# Altium schematic sheet 04-BLE.SchDoc: BLE Transreciver
size A3; DocumentNumber: 4; SheetNumber: 4; SheetTotal: 15
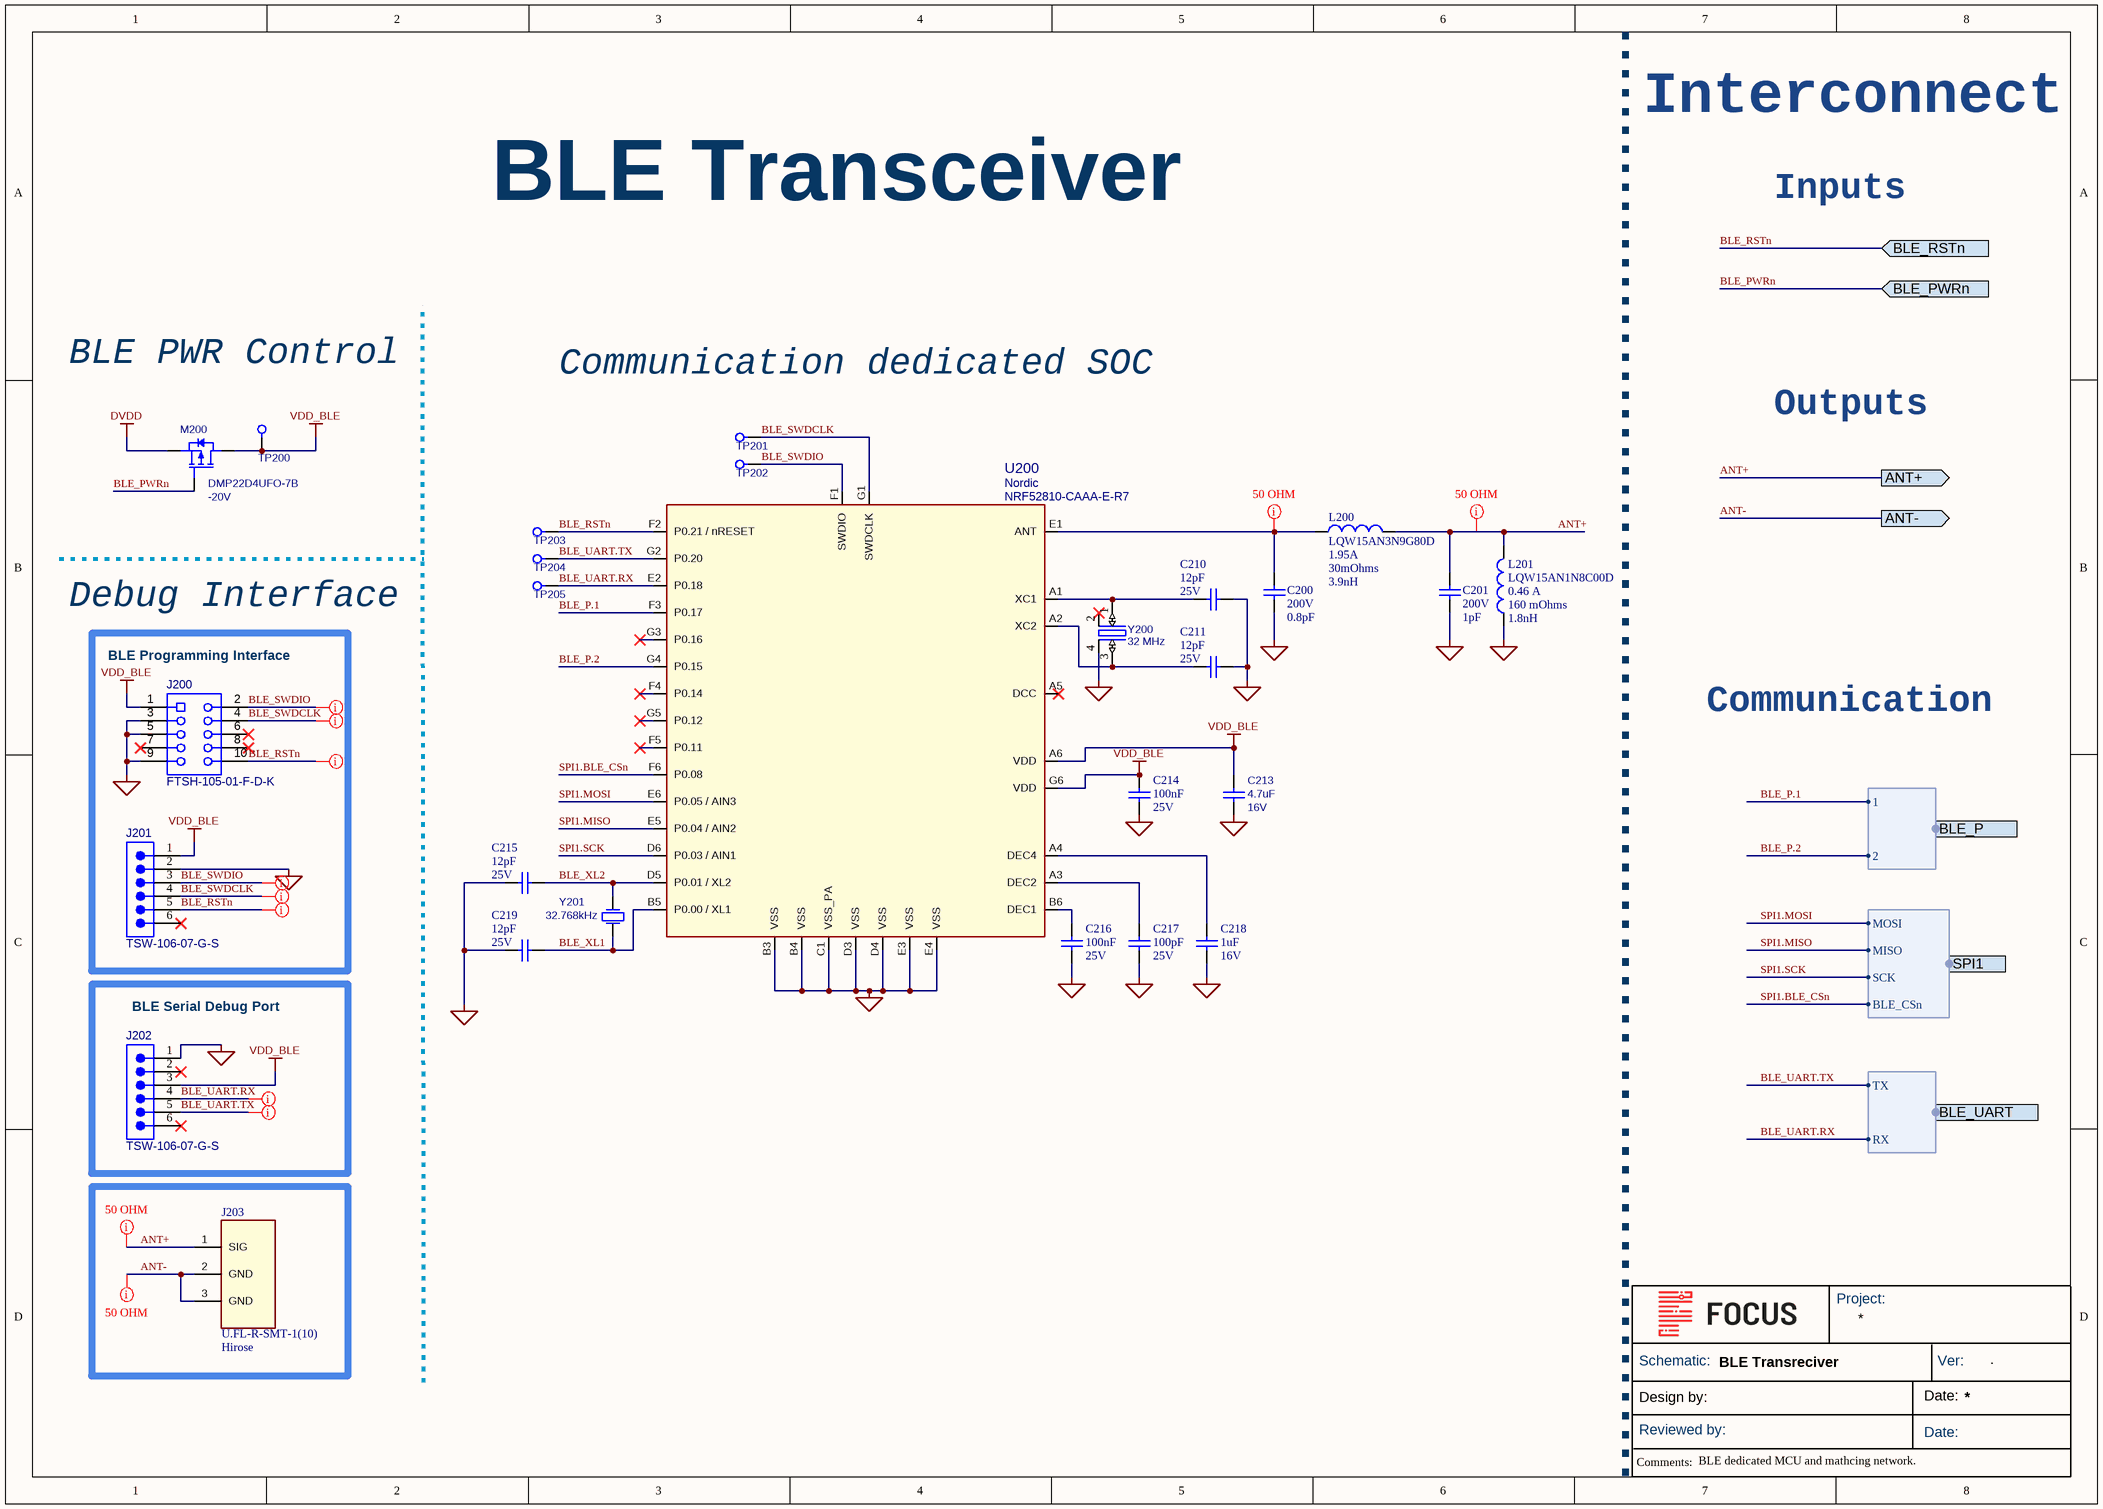
[diagram p0: 04-BLE.SchDoc]

## Parts
C200  value 0.8pF  Voltage Rating: 200V  [CAP0402_REDUCED]  (hidden comment: 600L0R8AT200T)
C201  value 1pF  Voltage Rating: 200V  [CAP0402_REDUCED]  (hidden comment: 600L1R0AT200T)
C210  value 12pF  Rated DC Voltage (URdc): 25V  [C0201_C]  (hidden comment: GRM0335C1E120JA01D)
C211  value 12pF  Rated DC Voltage (URdc): 25V  [C0201_C]  (hidden comment: GRM0335C1E120JA01D)
C213  value 4.7uF  Rating: 16V  [CAP0603_REDUCED]  (hidden comment: GRM188R61C475KE11)
C214  value 100nF  Rated DC Voltage (URdc): 25V  [C0201_C]  (hidden comment: GRM033R61E104KE14J)
C215  value 12pF  Rated DC Voltage (URdc): 25V  [C0201_C]  (hidden comment: GRM0335C1E120JA01D)
C216  value 100nF  Rated DC Voltage (URdc): 25V  [C0201_C]  (hidden comment: GRM033R61E104KE14J)
C217  value 100pF  Rated DC Voltage (URdc): 25V  [C0201_C]  (hidden comment: GRM033R71E101KA01D)
C218  value 1uF  Rated DC Voltage (URdc): 16V  [C0201_C]  (hidden comment: GRM033R61C105ME15D)
C219  value 12pF  Rated DC Voltage (URdc): 25V  [C0201_C]  (hidden comment: GRM0335C1E120JA01D)
J200  FTSH-105-01-F-D-K  [SAMTEC_FTSH-105-01-XXX-D-K]
J201  TSW-106-07-G-S  [SMTC-TSW-106-07-X-S]
J202  TSW-106-07-G-S  [SMTC-TSW-106-07-X-S]
J203  U.FL-R-SMT-1(10)  Manufacturer: Hirose  [FP-U_FL-R-SMT-1_10-MFG]
L200  LQW15AN3N9G80D  value 3.9nH  Current Rating: 1.95A  DC Resistance: 30mOhms  [L0402_C]
L201  LQW15AN1N8C00D  value 1.8nH  Current Rating: 0.46 A  DC Resistance: 160 mOhms  [L0402_C]
M200  Rating: -20V  [DIODESINC_X2-DFN0604-3]  (hidden comment: DMP22D4UFO-7B)
TP200  Test Point  [testpad_0.9mm]  (value not drawn)  (no BOM)
TP201  Test Point  [testpad_0.9mm]  (value not drawn)  (no BOM)
TP202  Test Point  [testpad_0.9mm]  (value not drawn)  (no BOM)
TP203  Test Point  [testpad_0.9mm]  (value not drawn)  (no BOM)
TP204  Test Point  [testpad_0.9mm]  (value not drawn)  (no BOM)
TP205  Test Point  [testpad_0.9mm]  (value not drawn)  (no BOM)
U200  Manufacturer: Nordic  [NORDIC_WLCSP_2.482x2.464]  (hidden comment: NRF52810-CAAA-E-R7)
Y200  value 32 MHz  [XTAL_ECS-SMD-CRYSTAL-10-48-CKY-TR]  (hidden comment: ECS-320-10-48-CKY-TR)
Y201  value 32.768kHz  [MICROCRYSTAL_CC8V-T1A]  (hidden comment: CM8V-T1A-32.768KHZ-6PF-20PPM-TA-QC)

## Ports
ANT+ (out), ANT- (out), BLE_P (harness BLE PINS), BLE_PWRn (in), BLE_RSTn (in), BLE_UART (harness UART), SPI1 (harness BLE_SPI)

## Harnesses
BLE_SPI: MOSI, MISO, BLE_CSn, SCK
BLE PINS: 1, 2
UART: TX, RX

## Nets
DVDD: M200.2(S)
GND: C200.1 C201.1 C210.2 C211.2 C213.2 C214.1 C215.1 C216.1 C217.1 C218.2 C219.1 J200.3 J200.5 J200.9 J201.2 J202.1 L201.1 U200.B3(VSS) U200.B4(VSS) U200.C1(VSS_PA) U200.D3(VSS) U200.D4(VSS) U200.E3(VSS) U200.E4(VSS) Y200.4(GND)
VDD_BLE: C213.1 C214.2 J200.1 J201.1 J202.3 M200.3(D) TP200.1 U200.A6(VDD) U200.G6(VDD)
ANT+: C201.2 J203.1(SIG) L200.2 L201.2 ; port ANT+
ANT-: J203.2(GND) J203.3(GND) ; port ANT-
BLE_P.1: U200.F3(P0.17) ; port BLE_P.1
BLE_P.2: U200.G4(P0.15) ; port BLE_P.2
BLE_PWRn: M200.1(G) ; port BLE_PWRn
BLE_RSTn: J200.10 J201.5 TP203.1 U200.F2(P0.21_/_nRESET) ; port BLE_RSTn
BLE_SWDCLK: J200.4 J201.4 TP201.1 U200.G1(SWDCLK)
BLE_SWDIO: J200.2 J201.3 TP202.1 U200.F1(SWDIO)
BLE_UART.RX: J202.4 TP205.1 U200.E2(P0.18) ; port BLE_UART.RX
BLE_UART.TX: J202.5 TP204.1 U200.G2(P0.20) ; port BLE_UART.TX
BLE_XL1: C219.2 U200.B5(P0.00_/_XL1) Y201.1
BLE_XL2: C215.2 U200.D5(P0.01_/_XL2) Y201.2
SPI1.BLE_CSn: U200.F6(P0.08) ; port SPI1.BLE_CSn
SPI1.MISO: U200.E5(P0.04_/_AIN2) ; port SPI1.MISO
SPI1.MOSI: U200.E6(P0.05_/_AIN3) ; port SPI1.MOSI
SPI1.SCK: U200.D6(P0.03_/_AIN1) ; port SPI1.SCK
NetC200_2: C200.2 L200.1 U200.E1(ANT)
NetC210_1: C210.1 U200.A1(XC1) Y200.1(IN/OUT)
NetC211_1: C211.1 U200.A2(XC2) Y200.3(OUT/IN)
NetC216_2: C216.2 U200.B6(DEC1)
NetC217_2: C217.2 U200.A3(DEC2)
NetC218_1: C218.1 U200.A4(DEC4)

Not connected (* = marked no-connect by the designer): J200 6* 7* 8*; J201 6*; J202 2* 6*; U200 A5(DCC)* F4(P0.14)* F5(P0.11)* G3(P0.16)* G5(P0.12)*; Y200 2(NC)*

## Layout directives
net class 50_OHM; rule Impedance Constraint [Min = 50.00    Max = 50.00    ]: ANT+, ANT-, NetC200_2
net class DIGITAL: BLE_RSTn, BLE_SWDCLK, BLE_SWDIO, BLE_UART.RX, BLE_UART.TX

## Notes on the sheet
- Interconnect
- BLE Transceiver
- Inputs
- BLE PWR Control
- Communication dedicated SOC
- Outputs
- Debug Interface
- (near J200) BLE Programming Interface
- Communication
- (near J202) BLE Serial Debug Port
- BLE dedicated MCU and mathcing network.
- Project:
- Schematic:
- Ver:
- .
- Design by:
- Reviewed by:
- Date:
- Comments:

## Library data of the parts
C200 = 600L0R8AT200T: Capacitor, 0.8pF, Silicon RF, 200V, Tolerance 0.05pF, 0402, Implant-grade; Manufacturer: Kyocera AVX; Medical Grade Manufacturer: TBD; Temperature Coefficient: 30 ppm/°C; Category: Capacitor; Manufacturer Part Number: 600L0R8AT200T; Medical Grade Manufacturer Part Number: TBD; Size Code: 0402; Supplier: TBD; Supplier Part Number: TBD; Height: 0.6mm; Width: 0.51mm; Length: 1.05mm; Tolerance: 0.05pF; Dielectric: -
C201 = 600L1R0AT200T: Capacitor, 1pF, RF Capacitors, 200V, Tolerance 0.01pF, 0402, Implant-grade; Manufacturer: Kyocera AVX; Medical Grade Manufacturer: TBD; Temperature Coefficient: 30 ppm/°C; Category: Capacitor; Manufacturer Part Number: 600L1R0AT200T; Medical Grade Manufacturer Part Number: TBD; Size Code: 0402; Supplier: TBD; Supplier Part Number: TBD; Height: 0.6mm; Width: 0.51mm; Length: 1.02mm; Tolerance: 0.01pF; Dielectric: -
C210 C211 C215 C219 = GRM0335C1E120JA01D: Ceramic Capacitor, Multilayer, Ceramic, 25V, 5% +Tol, 5% -Tol, C0G, 30ppm/Cel TC, 0.000012uF, Surface Mount, 0201; Manufacturer: Murata; Multilayer: Yes; Category: Ceramic Capacitors; Supplier: Digikey; Supplier Part Number: 490-3144-1-ND; Manufacturer Part Number: GRM0335C1E120JA01D; RoHS: Yes; Stock: 4384132; Pricing: 1=0,1, 10=0,011, 50=0,0062, 100=0,0048, 500=0,0036, 1000=0,00283, 2500=0,00258, 5000=0,00237 (USD); Mounting Technology: Surface Mount; Pins: 2; Dielectric Material: Ceramic; Package Shape: Rectangular; Case/Package: 0201; Terminal Finish: Nickel; Min Operating Temperature: -55°C; Max Operating Temperature: 125°C; Termination: Wraparound; JESD-609 Code: e3; Capacitor Type: Ceramic; Tolerance  (fill in as +-): 5%; Packaging: Tape and Reel; Tolerance (fill in as +-): 5%; Temperature Characteristics Code: C0G; Reach SVHC Compliant: Yes; RoHS Compliant: Yes; ComponentLink1URL: https://datasheet.ciiva.com:443/pdfs/VipMasterIC/IC/MURE/MURE-S-A0004347008/MURE-S-A0004348737-1.pdf?src-supplier=IHS+Markit; ComponentLink1Description: https://datasheet.ciiva.com:443/pdfs/VipMasterIC/IC/MURE/MURE-S-A0004347008/MURE-S-A0004348737-1.pdf?src-supplier=IHS+Markit; Supplier 1: Arrow Electronics; Supplier Part Number 1: GRM0335C1E120JA01D
C213 = GRM188R61C475KE11: Capacitor, 4.7uF, X5R, 16V, 10%, 0603, Implant-grade; Manufacturer: Murata; Medical Grade MFR PN: GCH188R61C475KE11; Length (mm): 1.60 ±0.10; Medical Grade MFR: Murata; PCB Footprint: cap0603_reduced; Thickness (mm): 0.80 ±0.10; Width (mm): 0.80 ±0.10; Category: Capacitor; Package Description: 0603; Check: *; Supplier 1: Arrow Electronics; Supplier Part Number 1: GRM188R61C475KE11D; Status: *; Review: *; Manufacturer Part Number: GRM188R61C475KE11
C214 C216 = GRM033R61E104KE14J: Ceramic Capacitor, Multilayer, Ceramic, 25V, 10% +Tol, 10% -Tol, X5R, 15% TC, 0.1uF, Surface Mount, 0201; Manufacturer: Murata; Multilayer: Yes; Category: Ceramic Capacitors; Supplier: Digikey; Supplier Part Number: 490-14571-1-ND; Manufacturer Part Number: GRM033R61E104KE14J; RoHS: Yes; Stock: 1540851; Pricing: 1=0,1, 10=0,033, 50=0,0192, 100=0,0148, 500=0,01118, 1000=0,00878, 2500=0,00798, 5000=0,00734 (USD); Mounting Technology: Surface Mount; Pins: 2; Dielectric Material: Ceramic; Package Shape: Rectangular; Case/Package: 0201; Terminal Finish: Nickel; Min Operating Temperature: -55°C; Max Operating Temperature: 85°C; JESD-609 Code: e3; Capacitor Type: Ceramic; Tolerance  (fill in as +-): 10%; Package Style: SMTMeter; Packaging: Tape and Reel; Tolerance (fill in as +-): 10%; Temperature Characteristics Code: X5R; Termination: Wraparound; Length: 0.6mm; Width: 0.3mm; Height: 0.3mm; Reach SVHC Compliant: Yes; RoHS Compliant: Yes; ComponentLink1URL: https://psearch.en.murata.com:443/capacitor/product/GRM033R61E104KE14%23.pdf?src-supplier=IHS+Markit; ComponentLink1Description: https://psearch.en.murata.com:443/capacitor/product/GRM033R61E104KE14%23.pdf?src-supplier=IHS+Markit; ComponentLink2URL: http://www.mouser.com/ds/2/281/c02e-2905.pdf?src-supplier=Mouser; ComponentLink2Description: http://www.mouser.com/ds/2/281/c02e-2905.pdf?src-supplier=Mouser; ComponentLink3URL: http://search.murata.co.jp/Ceramy/image/img/A01X/G101/ENG/GRM033R61E104KE14-01.pdf?src-supplier=Digikey; ComponentLink3Description: http://search.murata.co.jp/Ceramy/image/img/A01X/G101/ENG/GRM033R61E104KE14-01.pdf?src-supplier=Digikey; ComponentLink4URL: https://search.murata.co.jp/Ceramy/image/img/A01X/G101/ENG/GRM033R61E104KE14-01.pdf?src-supplier=Digikey; ComponentLink4Description: https://search.murata.co.jp/Ceramy/image/img/A01X/G101/ENG/GRM033R61E104KE14-01.pdf?src-supplier=Digikey; Supplier 1: Arrow Electronics; Supplier Part Number 1: GRM033R61E104KE14J
C217 = GRM033R71E101KA01D: Ceramic Capacitor, Multilayer, Ceramic, 25V, 10% +Tol, 10% -Tol, X7R, 15% TC, 0.0001uF, Surface Mount, 0201; Manufacturer: Murata; Multilayer: Yes; Category: Ceramic Capacitors; Supplier: Digikey; Supplier Part Number: 490-3172-1-ND; Manufacturer Part Number: GRM033R71E101KA01D; RoHS: Yes; Stock: 605708; Pricing: 1=0,1, 10=0,01, 50=0,0056, 100=0,0043, 500=0,00324, 1000=0,00255, 2500=0,00232, 5000=0,00213 (USD); Mounting Technology: Surface Mount; Pins: 2; Dielectric Material: Ceramic; Package Shape: Rectangular; Case/Package: 0201; Terminal Finish: Nickel; Min Operating Temperature: -55°C; Max Operating Temperature: 125°C; JESD-609 Code: e3; Capacitor Type: Ceramic; Tolerance  (fill in as +-): 10%; Package Style: SMTMeter; Packaging: Tape and Reel; Tolerance (fill in as +-): 10%; Temperature Characteristics Code: X7R; Termination: Wraparound; Length: 0.6mm; Width: 0.3mm; Height: 0.3mm; Reach SVHC Compliant: Yes; RoHS Compliant: Yes; ComponentLink1URL: https://psearch.en.murata.com:443/capacitor/product/GRM033R71E101KA01%23.pdf?src-supplier=IHS+Markit; ComponentLink1Description: https://psearch.en.murata.com:443/capacitor/product/GRM033R71E101KA01%23.pdf?src-supplier=IHS+Markit; ComponentLink2URL: https://datasheet.ciiva.com/129/grm033r71e101ka01-01-129915.pdf?src-supplier=Digikey; ComponentLink2Description: https://datasheet.ciiva.com/129/grm033r71e101ka01-01-129915.pdf?src-supplier=Digikey; ComponentLink3URL: https://datasheet.ciiva.com/129/grm033r71e101ka01-01-129916.pdf?src-supplier=Digikey; ComponentLink3Description: https://datasheet.ciiva.com/129/grm033r71e101ka01-01-129916.pdf?src-supplier=Digikey; ComponentLink4URL: https://datasheet.ciiva.com/129/grm033r71e101ka01-01-129917.pdf?src-supplier=Digikey; ComponentLink4Description: https://datasheet.ciiva.com/129/grm033r71e101ka01-01-129917.pdf?src-supplier=Digikey; ComponentLink5URL: https://datasheet.ciiva.com/18184/getdatasheetpartid-228478-18184102.pdf?src-supplier=Verical; ComponentLink5Description: https://datasheet.ciiva.com/18184/getdatasheetpartid-228478-18184102.pdf?src-supplier=Verical; ComponentLink6URL: https://datasheet.ciiva.com/29199/455792-da-01-en-vs-kondensator-0201-29199171.pdf?src-supplier=Conrad; ComponentLink6Description: https://datasheet.ciiva.com/29199/455792-da-01-en-vs-kondensator-0201-29199171.pdf?src-supplier=Conrad; ComponentLink7URL: https://datasheet.ciiva.com/11605/product-11605541.pdf?src-supplier=Avnet; ComponentLink7Description: https://datasheet.ciiva.com/11605/product-11605541.pdf?src-supplier=Avnet; ComponentLink8URL: https://datasheet.ciiva.com/16370/product-16370826.pdf?src-supplier=Future+Electronics; ComponentLink8Description: https://datasheet.ciiva.com/16370/product-16370826.pdf?src-supplier=Future+Electronics; Supplier 1: Arrow Electronics; Supplier Part Number 1: GRM033R71E101KA01D
C218 = GRM033R61C105ME15D: Ceramic Capacitor, Multilayer, Ceramic, 16V, 20% +Tol, 20% -Tol, X5R, 15% TC, 1uF, Surface Mount, 0201; Manufacturer: Murata; Category: Ceramic Capacitors; Supplier: Digikey; Supplier Part Number: 490-18654-1-ND; Manufacturer Part Number: GRM033R61C105ME15D; RoHS: No; Stock: 132893; Pricing: 1=0,16, 10=0,105, 50=0,0628, 100=0,0493, 500=0,03644, 1000=0,03017, 2500=0,02808, 5000=0,02569 (USD); Supplier 1: Avnet; Supplier Part Number 1: GRM033R61C105ME15D
J200 = FTSH-105-01-F-D-K: Connector, 1.27 mm, 2x5, Male, TH; Manufacturer: Samtec; Review: 020823; Value: FTSH-105-01-F-D-K; Supplier 1: Mouser; Supplier Part Number 1: 200-FTSH10501FDK; Status: Approved; Manufacturer Part Number: FTSH-105-01-F-D-K
J201 J202 = TSW-106-07-G-S: 0.025" SQ Post Header, Through-hole, Vertical, -55 to 125 degC, 2.54 mm Pitch, 6-Pin, Male, RoHS; Manufacturer: Samtec; Pitch: 2.54 mm; Connector Type: BOARD CONNECTOR; Number of Rows Loaded: 1; Number of Contacts: 6; Option: General Purpose; Filter Feature: No; Additional Feature: E.L.P.; Body/Shell Style: RECEPTACLE; Contact Pattern: RECTANGULAR; Contact Style: SQ PIN-SKT; Mating Information: MULTIPLE MATING PARTS AVAILABLE; Body Breadth: 0.1inch; Plating Thickness: 10uin; Reference Standard: UL; Reliability: COMMERCIAL; RoHS: True; ComponentLink1Description: Manufacturer URL; DatasheetVersion: F-214; Orientation: Vertical; ComponentLink1URL: http://www.samtec.com; ComponentLink3Description: Package Specification; ComponentLink2Description: Datasheet; PackageVersion: DM, 8/1988; PackageDescription: .025[0.64] SQ. Post Terminal Strip Assembly; PackageReference: TSW-106-07-X-S; Mounting Technology: Through-hole; Temperature Range: -55 to 125 degC; ComponentLink3URL: http://www.samtec.com/documents/webfiles/cpdf/TSW-XXX-XX-XXX-X-XX-XXX-MKT.pdf; ComponentLink2URL: http://www.samtec.com/documents/webfiles/pdf/TSW_TH.PDF; PartNumber: TSW-106-07-G-S; Supplier: Arrow Electronics; Supplier Part Number: TSW-106-07-G-S; Manufacturer Part Number: TSW-106-07-G-S; Category: Connectors; Stock: 414060; Pricing: 1=0,89, 50=0,69, 100=0,56, 500=0,47, 1000=0,35, 2000=0,31, 5000=0,23 (USD); Contact Finish - Mating: GOLD (10) OVER NICKEL (50); Contact Finish - Termination: Gold (Au) - with Nickel (Ni) barrier; Contact Material: Bronze; Insulation Color: Black; Insulation Material: Glass; JESD-609 Code: e4; Contact Gender: Male; Mounting Style: STRAIGHT; Termination: Solder; Mixed Contacts: No; Number Of Connectors: 1; Number Of PCB Rows: 1; PCB Contact Pattern: RECTANGULAR; Terminal Pitch: 2.54mm; Body Depth: 0.1inch; Mating Contact Pitch: 0.1inch; Terminal Length: 0.1inch; Reach SVHC Compliant: Yes; RoHS Compliant: Yes; DIN Conformance: No; IEC Conformance: No; MIL Conformance: No; ComponentLink4URL: https://datasheet.ciiva.com:443/pdfs/VipMasterIC/IC/SAMI/SAMI-S-A0002522030/SAMI-S-A0002522030-1.pdf?src-supplier=IHS+Markit; ComponentLink4Description: https://datasheet.ciiva.com:443/pdfs/VipMasterIC/IC/SAMI/SAMI-S-A0002522030/SAMI-S-A0002522030-1.pdf?src-supplier=IHS+Markit; ComponentLink5URL: https://datasheet.ciiva.com/6888/tsw-xxx-xx-xxx-x-xx-xxx-mkt-6888455.pdf?src-supplier=Digi-Key; ComponentLink5Description: https://datasheet.ciiva.com/6888/tsw-xxx-xx-xxx-x-xx-xxx-mkt-6888455.pdf?src-supplier=Digi-Key; ComponentLink6URL: https://datasheet.ciiva.com/9486/htsw-th-9486442.pdf?src-supplier=Avnet; ComponentLink6Description: https://datasheet.ciiva.com/9486/htsw-th-9486442.pdf?src-supplier=Avnet; Supplier 1: Arrow Electronics; Supplier Part Number 1: TSW-106-07-G-S
J203 = U.FL-R-SMT-1(10): RF Connector, 1 Contact(s), Male, Board Mount, Surface Mount Terminal, Receptacle; Durability: 30Cycles; Insulation Resistance: 500MR; Number of Ports: 1; Operating Frequency-Max: 6kHz; Option: General Purpose; Characteristic Impedance: 50R; Contact Resistance: 20mR; Contact Style: Coax; Coupling Type: Snap; Dielectric Withstanding Voltage (AC): 200V; Filter Feature: No; Mating Information: MULTIPLE MATING PARTS AVAILABLE; Panel Mount: No; VSWR: 1.5; Insertion Loss: 0.05dB; Body Depth: 0.098inch; Mounting Option 1: LOCKING; Body Diameter: 0.079inch; Reference Standard: UL; Reliability: COMMERCIAL; Supplier: Digi-Key; Supplier Part Number: H11891CT-ND; Manufacturer Part Number: U.FL-R-SMT-1(10); RoHS: Yes; Category: RF / Coaxial Connectors; Stock: 112692; Pricing: 1=1,35, 10=1,138, 25=1,092, 50=1,0686, 100=1,0221, 250=0,9292, 500=0,83628, 1000=0,74336 (USD); Mounting Technology: Board; Insulation Material: Polymer; Shell Finish: Silver; Shell Material: CuSn; Contact Material: Bronze; Contact Finish - Mating: GOLD; Contact Finish - Termination: GOLD; Insulation Color: Beige; Min Operating Temperature: -40°C; Max Operating Temperature: 90°C; Connector Type: RF CONNECTOR; Body/Shell Style: RECEPTACLE; Contact Gender: Male; Mounting Style: STRAIGHT; Termination: SMD/SMT; Number of Contacts: 1; JESD-609 Code: e4; Reach SVHC Compliant: Yes; RoHS Compliant: Yes; DIN Conformance: No; IEC Conformance: No; MIL Conformance: No; ComponentLink1URL: https://datasheet.ciiva.com:443/pdfs/VipMasterIC/IC/HIRO/HIROS10696/HIROS08829-1.pdf?src-supplier=IHS+Markit; ComponentLink1Description: https://datasheet.ciiva.com:443/pdfs/VipMasterIC/IC/HIRO/HIROS10696/HIROS08829-1.pdf?src-supplier=IHS+Markit; ComponentLink2URL: https://datasheet.ciiva.com/11762/0900766b8105243f-11762474.pdf?src-supplier=Rs; ComponentLink2Description: https://datasheet.ciiva.com/11762/0900766b8105243f-11762474.pdf?src-supplier=Rs; ComponentLink3URL: https://datasheet.ciiva.com/7651/91524-7651914.pdf?src-supplier=Element14; ComponentLink3Description: https://datasheet.ciiva.com/7651/91524-7651914.pdf?src-supplier=Element14; ComponentLink4URL: https://datasheet.ciiva.com/7651/91524-7651915.pdf?src-supplier=Element14; ComponentLink4Description: https://datasheet.ciiva.com/7651/91524-7651915.pdf?src-supplier=Element14
L200 = LQW15AN3N9G80D: Inductor, 3.9nH, 1.95A, 2%, 0402; Manufacturer: Murata; Medical Grade Manufacturer: TBD; Shielding: Unshielded; Category: Inductor; Temperature Coefficient: -; Manufacturer Part Number: LQW15AN3N9G80D; Medical Grade Manufacturer Part Number: TBD; Size Code: 0402; Supplier: TBD; Supplier Part Number: TBD; Height: 0.5mm; Width: 0.6mm; Length: 1mm; Tolerance: 2%; Current Saturation: -; Supplier 1: Mouser; Supplier Part Number 1: 81-LQW15AN3N9G80D; Supplier 2: Digikey; Supplier Part Number 2: 490-LQW15AN3N9G80DCT-ND; Supplier 3: Digikey; Supplier Part Number 3: 490-LQW15AN3N9G80DDKR-ND; Supplier 4: Digikey; Supplier Part Number 4: 490-LQW15AN3N9G80DTR-ND
L201 = LQW15AN1N8C00D: Inductor, 1.8nH, 0.46A, Tolerance 0.2 nH, 0402; Manufacturer: Murata; Medical Grade Manufacturer: TBD; Tolerance: 0.2 nH; Shielding: Unshielded; Category: Inductor; Temperature Coefficient: -; Manufacturer Part Number: LQW15AN1N8C00D; Medical Grade Manufacturer Part Number: TBD; Size Code: 0402; Supplier: TBD; Supplier Part Number: TBD; Height: 0.5mm; Width: 0.6mm; Length: 1mm; Current Saturation: -; Supplier 1: Mouser; Supplier Part Number 1: 81-LQW15AN1N8C00D; Supplier 2: Digikey; Supplier Part Number 2: 490-14479-1-ND; Supplier 3: Digikey; Supplier Part Number 3: 490-14479-6-ND; Supplier 4: Digikey; Supplier Part Number 4: 490-14479-2-ND
M200 = DMP22D4UFO-7B: MOSFET, P-chan, -20V, -383mA, DFN0604; Manufacturer: Diodes Inc; Medical Grade MFR: TBD; Review: 020823; Category: Transistor; Length (mm): 0.60 ±0.05; Medical Grade MFR PN: TBD; PCB Footprint: TBD; Thickness (mm): 0.36 ±0.04; Value: DMP22D4UFO-7B; Width (mm): 0.40 ±0.05; Supplier 1: Digi-Key; Supplier Part Number 1: 31-DMP22D4UFO-7BCT-ND; Status: Approved; Manufacturer Part Number: DMP22D4UFO-7B
TP200-TP205 = Test Point: Test pad, 0.90mm circular pad; PCB Footprint: testpad_0p90mm; Length (mm): 0.90; Manufacturer: N/A; Manufacturer PN: N/A; Medical Grade MFR: N/A; Medical Grade MFR PN: N/A; Rating: N/A; Thickness (mm): N/A; Value: Test point; Width (mm): 0.90; Category: Test point; Status: *; Review: *
U200 = NRF52810-CAAA-E-R7: Bluetooth radio, v5.0, 192 kB Flash, 24 kB RAM, BGA-33; Medical Grade MFR: TBD; Category: IC; Length (mm): 2.48; Medical Grade MFR PN: TBD; Package Description: TBD; PCB Footprint: TBD; Rating: TBD; Thickness (mm): 0.48 ±0.06; Value: NRF52810-CAAA-E-R7; Width (mm): 2.46; Supplier 1: DigiKey; Supplier Part Number 1: 4823-NRF52810-CAAA-E-R7CT-ND; Status: *; Review: *; Manufacturer Part Number: NRF52810-CAAA-E-R7
Y200 = ECS-320-10-48-CKY-TR: 32 MHz Â±10ppm Crystal 10pF 100 Ohms 4-SMD, No Lead; Manufacturer: ECS Inc.; Medical Grade MFR: TBD; Category: Crystal; Length (mm): 1.20; Medical Grade MFR PN: TBD; PCB Footprint: TBD; Rating: N/A; Thickness (mm): 0.33; Width (mm): 1.00; Package Description: 4-SMD, No Lead; Supplier 1: Digi-Key; Supplier Part Number 1: XC3036CT-ND; Status: *; Review: *; Manufacturer Part Number: ECS-320-10-48-CKY-TR
Y201 = CM8V-T1A-32.768KHZ-6PF-20PPM-TA-QC: CRYSTAL 32.7680KHZ 6PF SMD; Manufacturer: Micro Crystal; Medical Grade MFR PN: CC8V-T1A32.768kHz6.0pF±20ppmTAQM; PCB Footprint: TBD; Review: 020823; Category: Crystal; Length (mm): 2.00; Medical Grade MFR: Micro Crystal; Rating: N/A; Thickness (mm): 0.67; Width (mm): 1.20; Package Description: CC8V; Supplier 1: Digi-Key; Supplier Part Number 1: 2195-CM8V-T1A-32.768KHZ-6PF-20PPM-TA-QCCT-ND; Status: Approved; Manufacturer Part Number: CM8V-T1A-32.768KHZ-6PF-20PPM-TA-QC